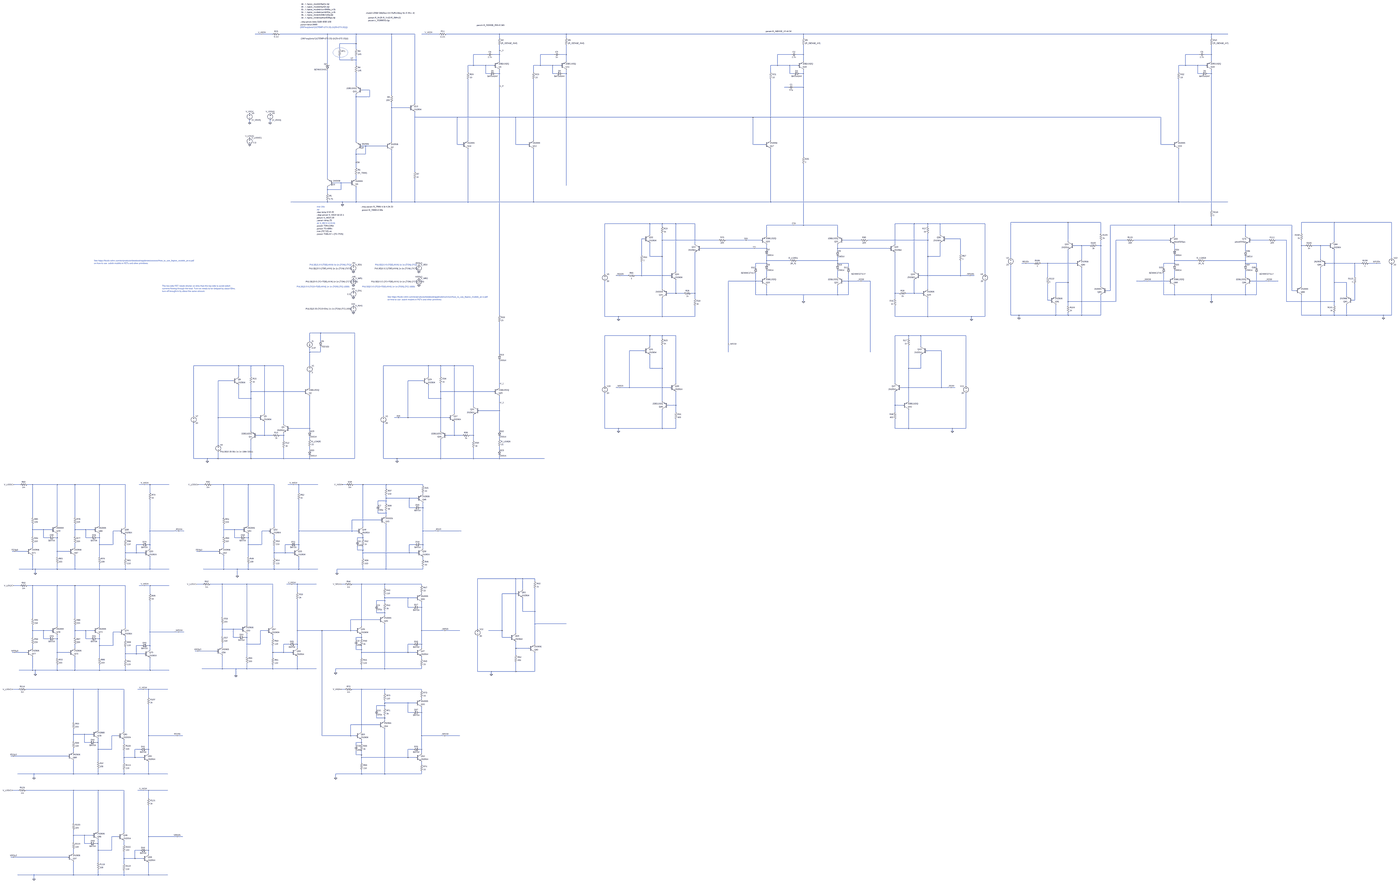
[diagram p0: schematic current_h_bridge_test_bed.asc, whole sheet]
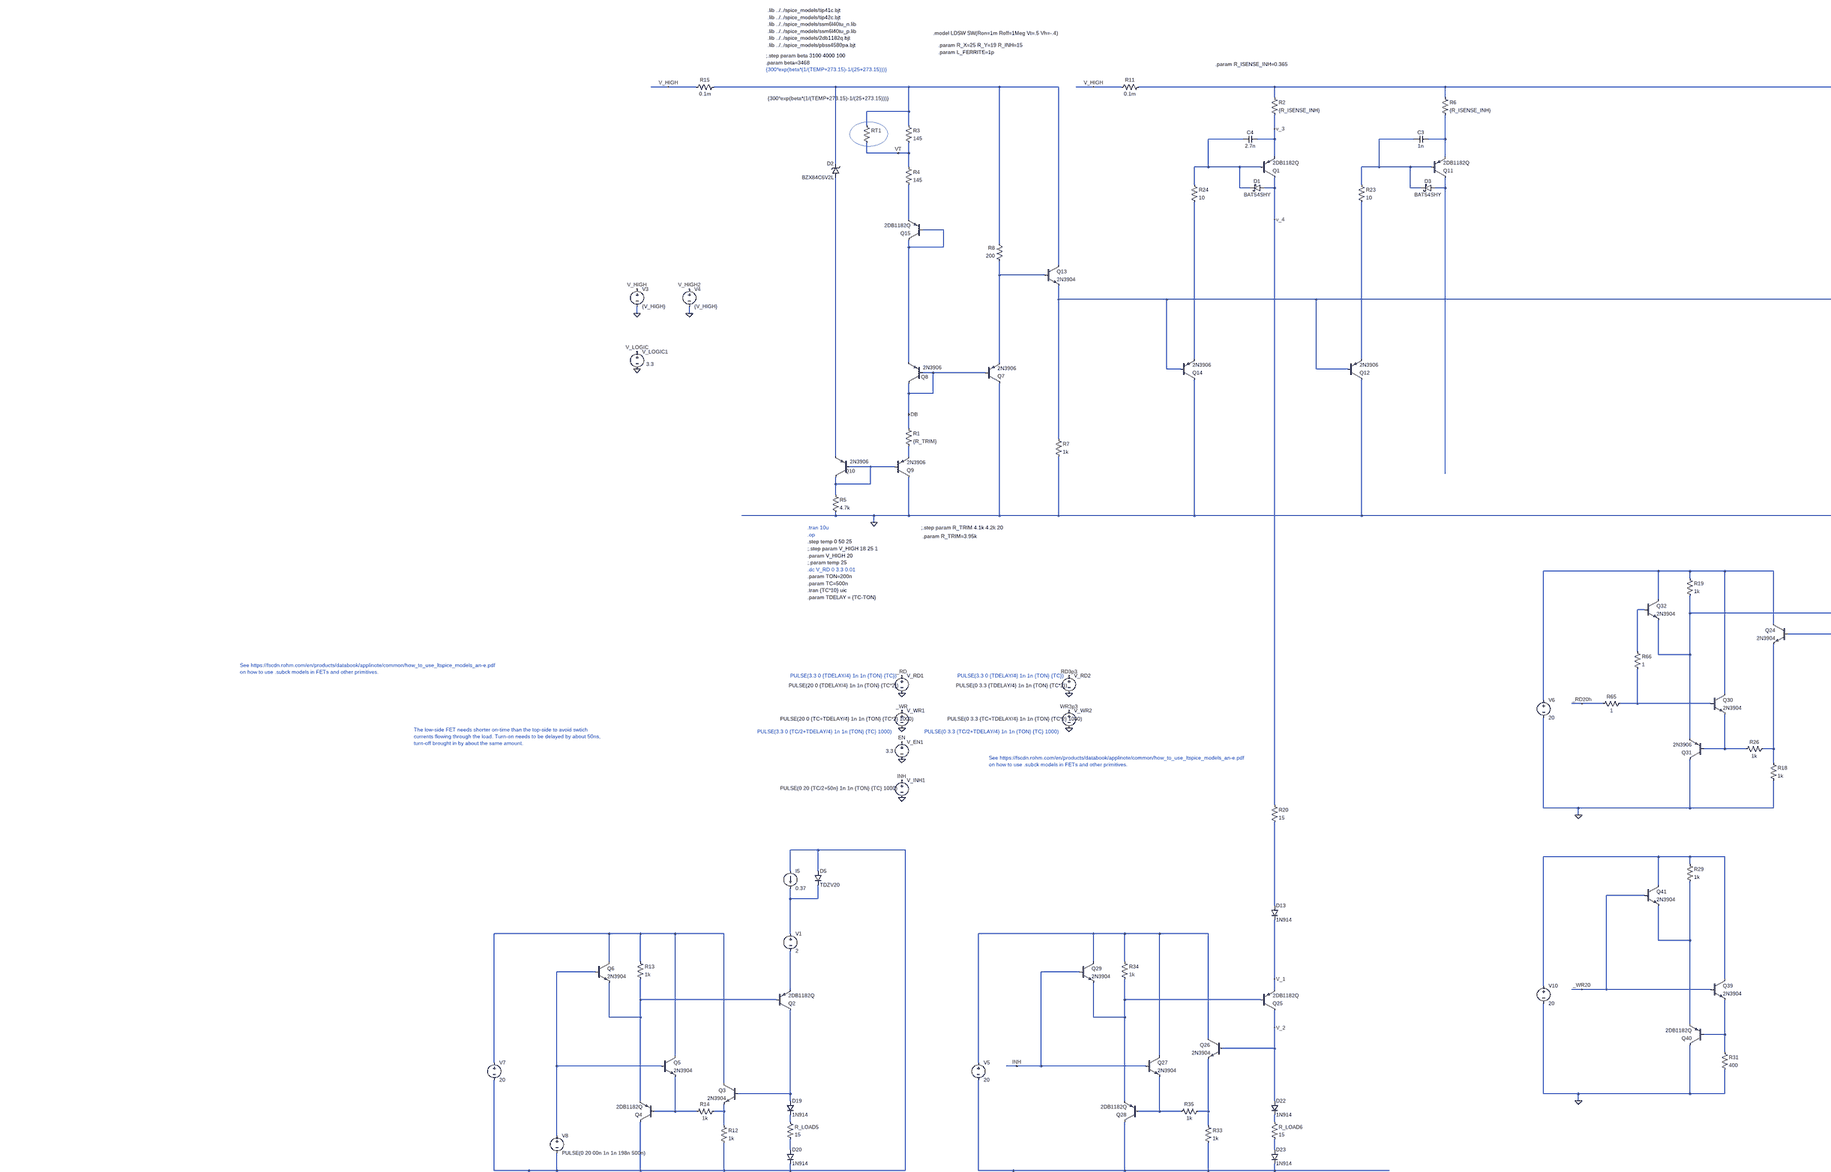
[diagram p1: schematic current_h_bridge_test_bed.asc, part, row 1 of 2, column 1 of 2]
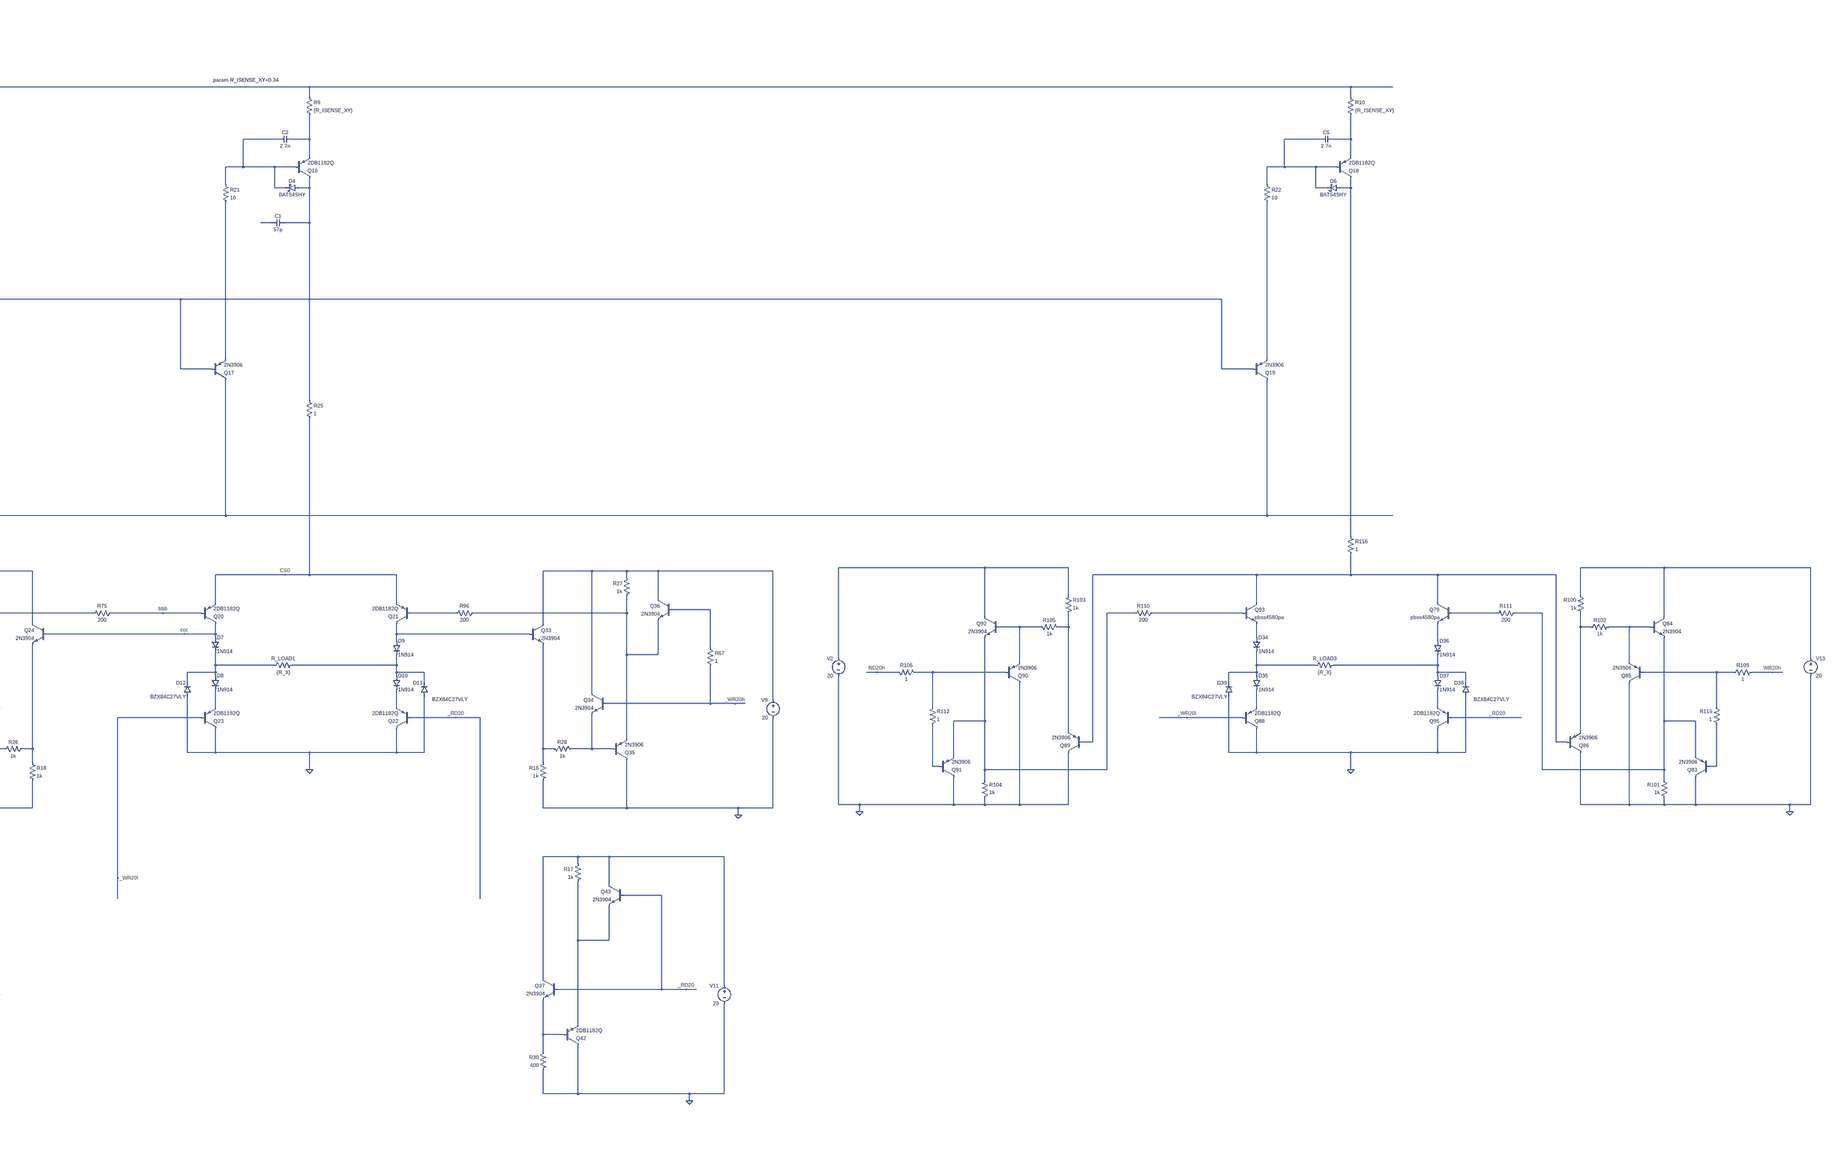
[diagram p2: schematic current_h_bridge_test_bed.asc, part, row 1 of 2, column 2 of 2]
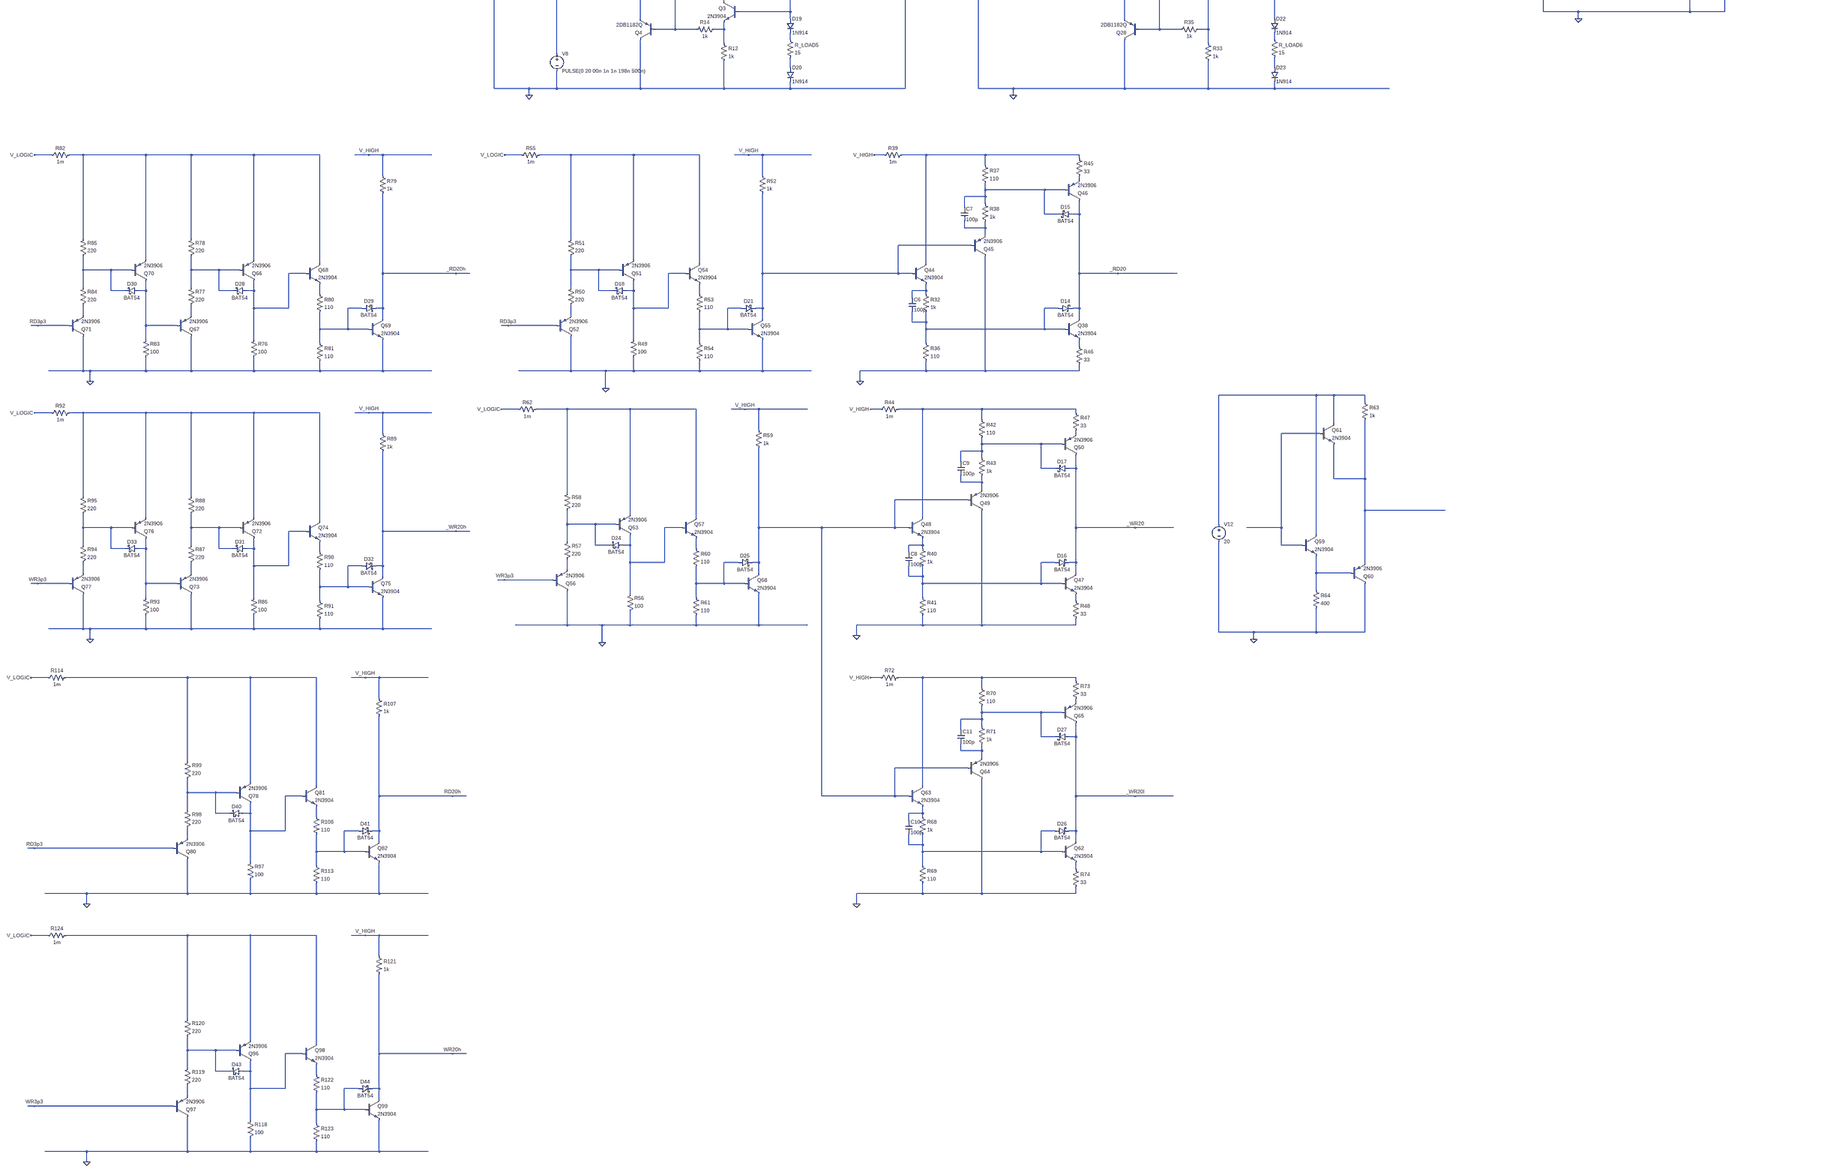
[diagram p3: schematic current_h_bridge_test_bed.asc, part, row 2 of 2, column 1 of 2]
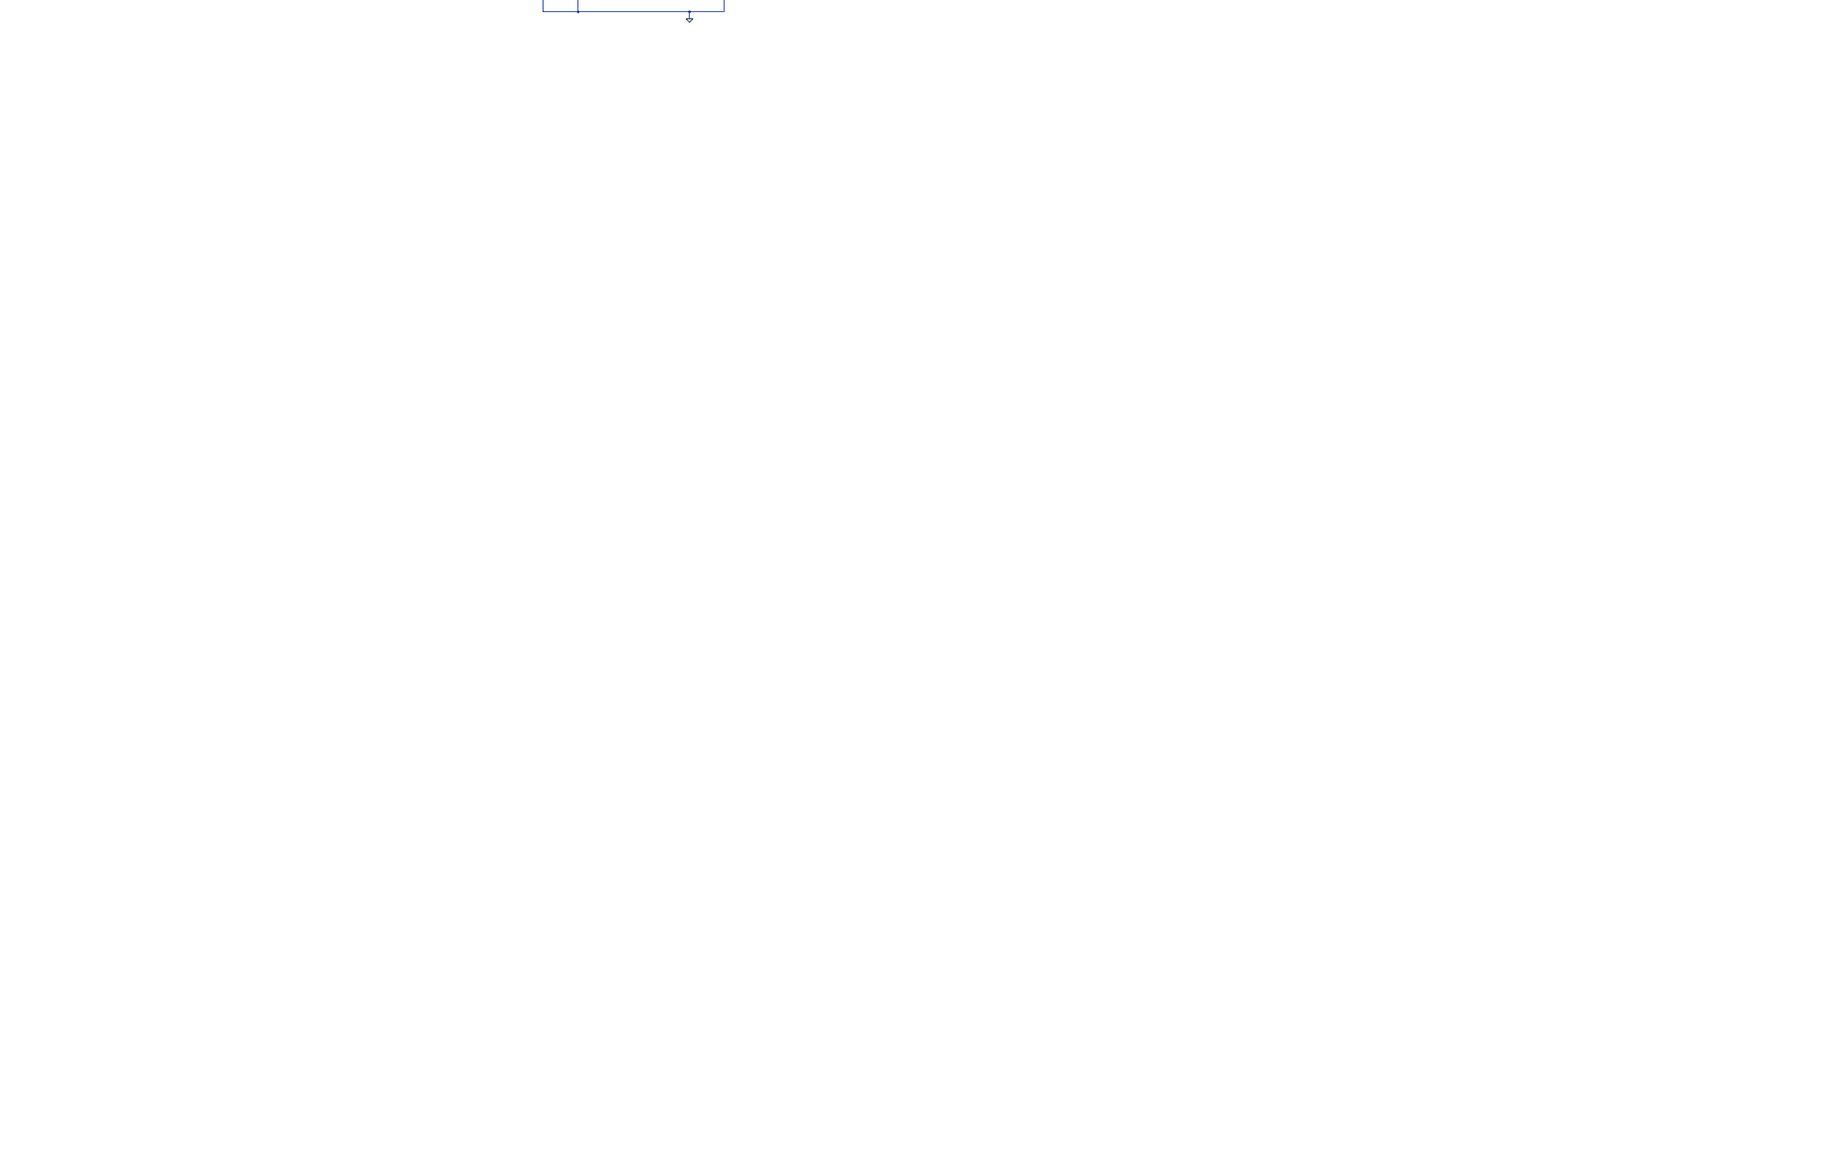
[diagram p4: schematic current_h_bridge_test_bed.asc, part, row 2 of 2, column 2 of 2]
* current_h_bridge_test_bed.asc
Q2 N077 N073 N072 0 2DB1182Q
R_LOAD5 N082 N084 15
D5 0 N065 TDZV20
I5 0 N065 0.37
Q3 N067 N077 N079 0 2N3904
V7 N067 0 20
R12 N079 0 1k
R13 N067 N073 1k
R14 N079 N078 1k
V8 N071 0 PULSE(0 20 00n 1n 1n 198n 500n)
Q5 N067 N071 N078 0 2N3904
Q4 0 N078 N073 0 2DB1182Q
Q6 N067 N071 N073 0 2N3904
V1 N065 N072 2
R1 DB N023 {R_TRIM}
R2 N002 v_3 {R_ISENSE_INH}
Q1 v_4 N003 v_3 0 2DB1182Q
Q7 0 DB N016 0 2N3906
Q8 DB DB N015 0 2N3906
R3 N001 VT 145
R4 VT N013 145
RT1 N001 VT {300*exp(beta*(1/(TEMP+273.15)-1/(25+273.15)))}
D1 v_4 N003 BAT54SHY
D2 N022 N001 BZX84C6V2L
R5 N024 0 4.7k
Q9 0 N024 N023 0 2N3906
Q10 N024 N024 N022 0 2N3906
R6 N002 N005 {R_ISENSE_INH}
Q11 N010 N004 N005 0 2DB1182Q
Q12 0 N017 N019 0 2N3906
D3 N010 N004 BAT54SHY
Q13 N001 N016 N017 0 2N3904
Q14 0 N017 N018 0 2N3906
R7 N017 0 1k
Q15 N015 N015 N013 0 2DB1182Q
R8 N016 N001 200
R9 N002 N007 {R_ISENSE_XY}
Q16 N011 N006 N007 0 2DB1182Q
Q17 0 N017 N020 0 2N3906
D4 N011 N006 BAT54SHY
R_LOAD1 N046 N047 {R_X}
R10 N002 N009 {R_ISENSE_XY}
Q18 N012 N008 N009 0 2DB1182Q
Q19 0 N017 N021 0 2N3906
D6 N012 N008 BAT54SHY
R11 V_HIGH N002 0.1m
R15 V_HIGH N001 0.1m
V3 V_HIGH 0 {V_HIGH}
D7 ccc N046 1N914
D8 N046 N053 1N914
D9 N043 N047 1N914
D10 N047 N054 1N914
D11 0 N047 BZX84C27VLY
D12 0 N046 BZX84C27VLY
V_RD1 _RD 0 PULSE(20 0 {TDELAY/4} 1n 1n {TON} {TC*2})
V_EN1 EN 0 3.3
V_LOGIC1 V_LOGIC 0 3.3
V_INH1 INH 0 PULSE(0 20 {TC/2+50n} 1n 1n {TON} {TC} 1000)
R21 N006 N020 10
C1 N011 N014 57p
C2 N007 N006 2.7n
R22 N008 N021 10
R23 N004 N019 10
R24 N003 N018 10
C3 N005 N004 1n
C4 v_3 N003 2.7n
C5 N009 N008 2.7n
R25 N011 CS0 1
V4 V_HIGH2 0 {V_HIGH}
V_WR1 _WR 0 PULSE(20 0 {TC+TDELAY/4} 1n 1n {TON} {TC*2} 1000)
D19 N077 N082 1N914
D20 N084 0 1N914
Q25 V_2 N074 V_1 0 2DB1182Q
R_LOAD6 N083 N085 15
Q26 N068 V_2 N081 0 2N3904
V5 N068 0 20
R33 N081 0 1k
R34 N068 N074 1k
R35 N081 N080 1k
Q27 N068 INH N080 0 2N3904
Q28 0 N080 N074 0 2DB1182Q
Q29 N068 INH N074 0 2N3904
D22 V_2 N083 1N914
D23 N085 0 1N914
D13 N066 V_1 1N914
R20 v_4 N066 15
Q20 ccc bbb CS0 0 2DB1182Q
Q21 N043 N033 CS0 0 2DB1182Q
V_RD2 RD3p3 0 PULSE(0 3.3 {TDELAY/4} 1n 1n {TON} {TC*2})
V_WR2 WR3p3 0 PULSE(0 3.3 {TC+TDELAY/4} 1n 1n {TON} {TC*2} 1000)
Q24 N027 ccc N058 0 2N3904
V6 N027 0 20
R18 N058 0 1k
R19 N027 N032 1k
R26 N058 N057 1k
Q30 N027 N052 N057 0 2N3904
Q31 0 N057 N032 0 2N3906
Q32 N027 N030 N032 0 2N3904
Q33 N028 N043 N059 0 2N3904
V9 N028 0 20
R16 N059 0 1k
R27 N028 N034 1k
R28 N059 N060 1k
Q34 N028 _WR20h N060 0 2N3904
Q35 0 N060 N034 0 2N3906
Q36 N028 N031 N034 0 2N3904
Q23 0 _WR20l N053 0 2DB1182Q
V10 N063 0 20
R29 N063 N069 1k
Q39 N063 _WR20 N075 0 2N3904
Q40 0 N075 N069 0 2DB1182Q
Q41 N063 _WR20 N069 0 2N3904
R31 N075 0 400
V11 N064 0 20
R17 N064 N070 1k
Q37 N064 _RD20 N076 0 2N3904
Q42 0 N076 N070 0 2DB1182Q
Q43 N064 _RD20 N070 0 2N3904
R30 N076 0 400
Q22 0 _RD20 N054 0 2DB1182Q
Q38 _RD20 N104 N108 0 2N3904
D14 N104 _RD20 BAT54
Q44 N088 N092 N099 0 2N3904
R32 N099 N104 1k
R36 N104 0 110
C6 N099 N104 100p
Q45 0 N092 N091 0 2N3906
R37 N088 N090 110
R38 N090 N091 1k
C7 N090 N091 100p
D15 _RD20 N090 BAT54
Q46 _RD20 N090 N089 0 2N3906
R39 V_HIGH N088 1m
R45 N088 N089 33
R46 N108 0 33
D18 N097 N095 BAT54
R49 0 N097 100
R50 N107 N095 220
R51 N095 N087 220
Q51 N097 N095 N087 0 2N3906
Q52 0 RD3p3 N107 0 2N3906
D21 N103 N092 BAT54
R52 V_HIGH N092 1k
R53 N101 N103 110
R54 N103 0 110
Q54 N087 N097 N101 0 2N3904
Q55 N092 N103 0 0 2N3904
R55 V_LOGIC N087 1m
Q47 _WR20 N129 N135 0 2N3904
D16 N129 _WR20 BAT54
Q48 N111 N118 N124 0 2N3904
R40 N124 N129 1k
R41 N129 0 110
C8 N124 N129 100p
Q49 0 N118 N117 0 2N3906
R42 N111 N115 110
R43 N115 N117 1k
C9 N115 N117 100p
D17 _WR20 N115 BAT54
Q50 _WR20 N115 N113 0 2N3906
R44 V_HIGH N111 1m
R47 N111 N113 33
R48 N135 0 33
D24 N122 N119 BAT54
R56 0 N122 100
R57 N131 N119 220
R58 N119 N110 220
Q53 N122 N119 N110 0 2N3906
Q56 0 WR3p3 N131 0 2N3906
D25 N128 N118 BAT54
R59 V_HIGH N118 1k
R60 N126 N128 110
R61 N128 0 110
Q57 N110 N122 N126 0 2N3904
Q58 N118 N128 0 0 2N3904
R62 V_LOGIC N110 1m
V12 N109 0 20
R63 N109 N116 1k
Q59 N109 N114 N134 0 2N3904
Q60 0 N134 N116 0 2N3906
Q61 N109 N114 N116 0 2N3904
R64 N134 0 400
R65 N052 _RD20h 1
R66 N030 N052 1
R67 N031 _WR20h 1
Q62 _WR20l N146 N148 0 2N3904
D26 N146 _WR20l BAT54
Q63 N137 N118 N143 0 2N3904
R68 N143 N146 1k
R69 N146 0 110
C10 N143 N146 100p
Q64 0 N118 N140 0 2N3906
R70 N137 N139 110
R71 N139 N140 1k
C11 N139 N140 100p
D27 _WR20l N139 BAT54
Q65 _WR20l N139 N138 0 2N3906
R72 V_HIGH N137 1m
R73 N137 N138 33
R74 N148 0 33
D28 N096 N094 BAT54
R76 0 N096 100
R77 N106 N094 220
R78 N094 N086 220
Q66 N096 N094 N086 0 2N3906
Q67 0 N098 N106 0 2N3906
D29 N102 _RD20h BAT54
R79 V_HIGH _RD20h 1k
R80 N100 N102 110
R81 N102 0 110
Q68 N086 N096 N100 0 2N3904
Q69 _RD20h N102 0 0 2N3904
R82 V_LOGIC N086 1m
D30 N098 N093 BAT54
R83 0 N098 100
R84 N105 N093 220
R85 N093 N086 220
Q70 N098 N093 N086 0 2N3906
Q71 0 RD3p3 N105 0 2N3906
D31 N123 N121 BAT54
R86 0 N123 100
R87 N133 N121 220
R88 N121 N112 220
Q72 N123 N121 N112 0 2N3906
Q73 0 N125 N133 0 2N3906
D32 N130 _WR20h BAT54
R89 V_HIGH _WR20h 1k
R90 N127 N130 110
R91 N130 0 110
Q74 N112 N123 N127 0 2N3904
Q75 _WR20h N130 0 0 2N3904
R92 V_LOGIC N112 1m
D33 N125 N120 BAT54
R93 0 N125 100
R94 N132 N120 220
R95 N120 N112 220
Q76 N125 N120 N112 0 2N3906
Q77 0 WR3p3 N132 0 2N3906
R75 bbb N032 200
R96 N034 N033 200
R_LOAD3 N048 N049 {R_X}
D34 N044 N048 1N914
D35 N048 N055 1N914
D36 N045 N049 1N914
D37 N049 N056 1N914
D38 0 N049 BZX84C27VLY
D39 0 N048 BZX84C27VLY
Q88 0 _WR20l N055 0 2DB1182Q
Q95 0 _RD20 N056 0 2DB1182Q
R110 N036 N035 200
R111 N038 N037 200
V2 N025 0 20
R103 N040 N025 1k
R104 0 N035 1k
R105 N040 N039 1k
Q91 0 N061 N035 0 2N3906
Q92 N025 N039 N035 0 2N3904
R106 N050 RD20h 1
R112 N061 N050 1
Q90 0 N050 N039 0 2N3906
Q89 0 N029 N040 0 2N3906
Q93 N029 N036 N044 0 pbss4580pa
D40 N142 N141 BAT54
R97 0 N142 100
R98 N147 N141 220
R99 N141 N136 220
Q78 N142 N141 N136 0 2N3906
Q80 0 RD3p3 N147 0 2N3906
D41 N145 RD20h BAT54
R107 V_HIGH RD20h 1k
R108 N144 N145 110
R113 N145 0 110
Q81 N136 N142 N144 0 2N3904
Q82 RD20h N145 0 0 2N3904
R114 V_LOGIC N136 1m
D43 N151 N150 BAT54
R118 0 N151 100
R119 N154 N150 220
R120 N150 N149 220
Q96 N151 N150 N149 0 2N3906
Q97 0 WR3p3 N154 0 2N3906
D44 N153 WR20h BAT54
R121 V_HIGH WR20h 1k
R122 N152 N153 110
R123 N153 0 110
Q98 N149 N151 N152 0 2N3904
Q99 WR20h N153 0 0 2N3904
R124 V_LOGIC N149 1m
V13 N026 0 20
R100 N041 N026 1k
R101 0 N038 1k
R102 N041 N042 1k
Q83 0 N062 N038 0 2N3906
Q84 N026 N042 N038 0 2N3904
R109 N051 WR20h 1
R115 N062 N051 1
Q85 0 N051 N042 0 2N3906
Q86 0 N029 N041 0 2N3906
Q79 N029 N037 N045 0 pbss4580pa
R116 N012 N029 1
.model D D
.lib standard.dio
.model NPN NPN
.model PNP PNP
.lib standard.bjt
.lib ../../spice_models/tip42c.bjt
.lib ../../spice_models/tip41c.bjt
.step temp 0 50 25
* .op
;.step param V_HIGH 18 25 1
.param beta=3468
;.step param beta 3100 4000 100
* {300*exp(beta*(1/(TEMP+273.15)-1/(25+273.15)))}
.param L_FERRITE=1p
.param R_X=25 R_Y=19 R_INH=15
.param R_ISENSE_INH=0.365
;.step param R_TRIM 4.1k 4.2k 20
.param R_TRIM=3.95k
.param V_HIGH 20
;.param temp 25
.model LDSW SW(Ron=1m Roff=1Meg Vt=.5 Vh=-.4)
* .tran 10u
.param R_ISENSE_XY=0.34
.tran {TC*10} uic
.param TON=200n
.param TC=500n
* .dc V_RD 0 3.3 0.01
* PULSE(3.3 0 {TDELAY/4} 1n 1n {TON} {TC})
.lib ../../spice_models/ssm6l40tu_n.lib
.lib ../../spice_models/ssm6l40tu_p.lib
* See https://fscdn.rohm.com/en/products/databook/applinote/common/how_to_use_ltspice_models_an-e.pdf
* on how to use .subck models in FETs and other primitives.
* See https://fscdn.rohm.com/en/products/databook/applinote/common/how_to_use_ltspice_models_an-e.pdf
* on how to use .subck models in FETs and other primitives.
.param TDELAY = {TC-TON}
.lib ../../spice_models/2db1182q.bjt
* PULSE(3.3 0 {TC/2+TDELAY/4} 1n 1n {TON} {TC} 1000)
* The low-side FET needs shorter on-time than the top-side to avoid swtich
* currents flowing through the load. Turn-on needs to be delayed by about 50ns,
* turn-off brought in by about the same amount.
.lib ../../spice_models/pbss4580pa.bjt
* PULSE(3.3 0 {TDELAY/4} 1n 1n {TON} {TC})
* PULSE(0 3.3 {TC/2+TDELAY/4} 1n 1n {TON} {TC} 1000)
.backanno
.end